# EAGLE design CBUS Pico TH adapter rev A (EAGLE 9.6.2)
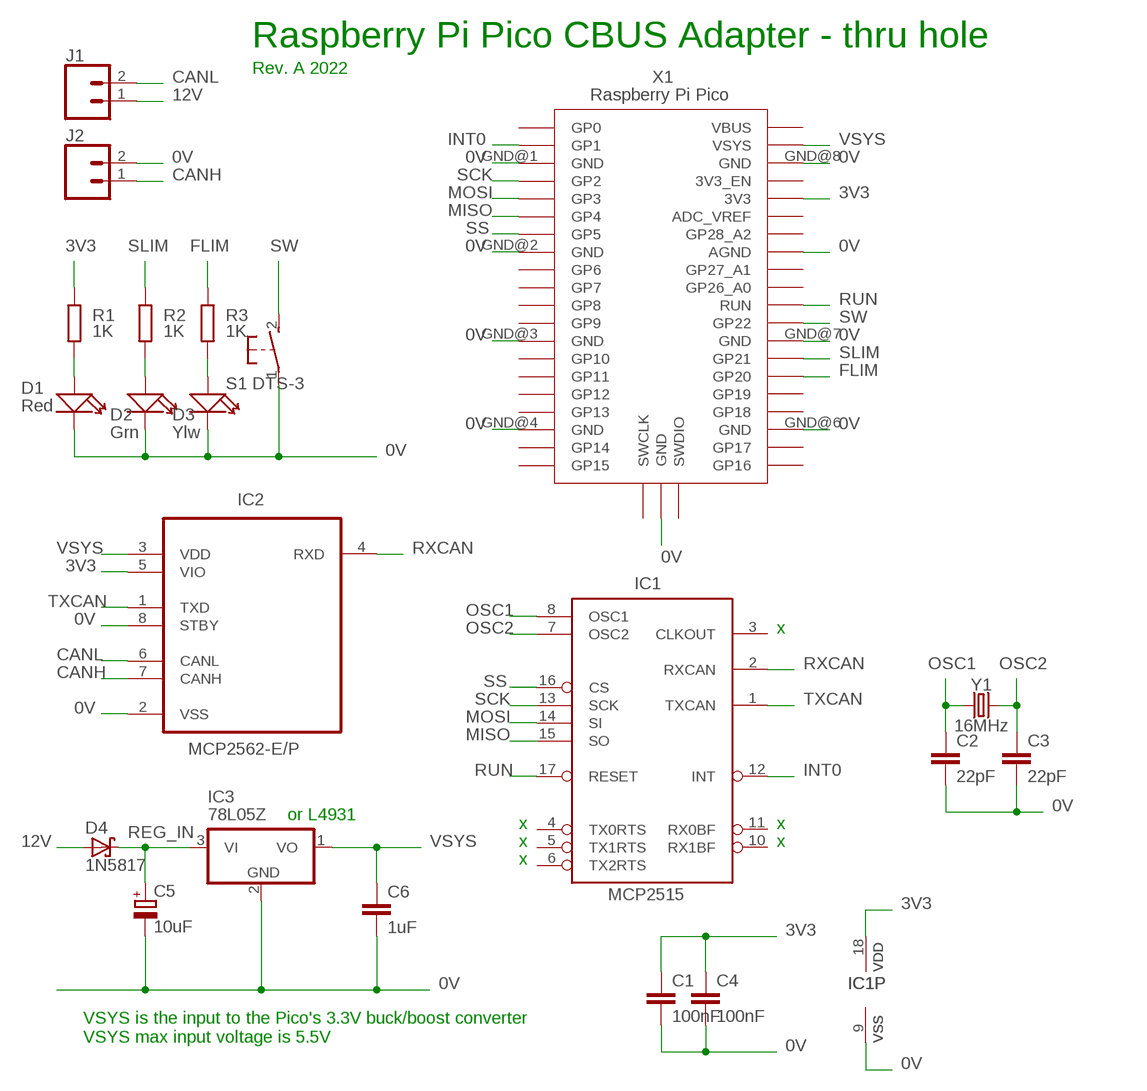
[diagram p0: schematic, sheet 1]

## Parts
C1  100nF  C-EU025-025X050  [C025-025X050]
C2  22pF  C-EU025-025X050  [C025-025X050]
C3  22pF  C-EU025-025X050  [C025-025X050]
C4  100nF  C-EU025-025X050  [C025-025X050]
C5  10uF  CPOL-EUE2-4  [E2-4]
C6  1uF  C-EU025-025X050  [C025-025X050]
D1  Red  DIP-LED-RED-RED(2P-D3MM)  [LED2-2.54-D3.0MM]
D2  Grn  DIP-LED-RED-RED(2P-D3MM)  [LED2-2.54-D3.0MM]
D3  Ylw  DIP-LED-RED-RED(2P-D3MM)  [LED2-2.54-D3.0MM]
D4  1N5817  SCHOTTKY-DIODEDO41  [DO41-10]
IC1  MCP2515  MCP2515(MCP2510)P  [DIP18]
IC2  MCP2562-E/P  [DIP254P762X533-8]
IC3  78L05Z  [TO92]
J1  CONN_023.5MM  [SCREWTERMINAL-3.5MM-2]
J2  CONN_023.5MM  [SCREWTERMINAL-3.5MM-2]
R1  1K  R-EU_0207/10  [0207/10]
R2  1K  R-EU_0207/10  [0207/10]
R3  1K  R-EU_0207/10  [0207/10]
S1  DTS-3  [DTS-3]
X1  Raspberry Pi Pico  RPI_PICO_IG-TH  [RPI_PICO_TH]
Y1  16MHz  CRYSTAL-16MHZPTH-HC49US  [HC49US]

## Nets
0V [power]: C1.2 C2.2 C3.2 C4.2 C5.- C6.2 D1.K(-) D2.K(-) D3.K(-) IC1.9(VSS) IC2.2(VSS) IC2.8(STBY) IC3.2(GND) J2.2 S1.1 X1.AGND X1.GND@1(GND) X1.GND@2(GND) X1.GND@3(GND) X1.GND@4(GND) X1.GND@5(GND) X1.GND@6(GND) X1.GND@7(GND) X1.GND@8(GND)
3V3 [power]: C1.1 C4.1 IC1.18(VDD) IC2.5(VIO) R1.1 X1.3V3
12V [power2]: D4.A J1.1
CANH: IC2.7(CANH) J2.1
CANL: IC2.6(CANL) J1.2
FLIM: R3.1 X1.GP20
INT0: IC1.12(INT) X1.GP1
MISO: IC1.15(SO) X1.GP4
MOSI: IC1.14(SI) X1.GP3
N$2: D1.A(+) R1.2
N$3: D2.A(+) R2.2
N$4: D3.A(+) R3.2
OSC1: C2.1 IC1.8(OSC1) Y1.1
OSC2: C3.1 IC1.7(OSC2) Y1.2
REG_IN [power2]: C5.+ D4.C IC3.3(VI)
RUN: IC1.17(RESET) X1.RUN
RXCAN: IC1.2(RXCAN) IC2.4(RXD)
SCK: IC1.13(SCK) X1.GP2
SLIM: R2.1 X1.GP21
SS: IC1.16(CS) X1.GP5
SW: S1.2 X1.GP22
TXCAN: IC1.1(TXCAN) IC2.1(TXD)
VSYS [power]: C6.1 IC2.3(VDD) IC3.1(VO) X1.VSYS
Unconnected: IC1.3(CLKOUT) IC1.4(TX0RTS) IC1.5(TX1RTS) IC1.6(TX2RTS) IC1.10(RX1BF) IC1.11(RX0BF) X1.3V3_EN X1.ADC_VREF X1.GP0 X1.GP6 X1.GP7 X1.GP8 X1.GP9 X1.GP10 X1.GP11 X1.GP12 X1.GP13 X1.GP14 X1.GP15 X1.GP16 X1.GP17 X1.GP18 X1.GP19 X1.GP26_A0 X1.GP27_A1 X1.GP28_A2 X1.SWCLK X1.SWDIO X1.VBUS

## Notes on the sheet
- Raspberry Pi Pico CBUS Adapter - thru hole
- Rev. A 2022
- x
- or L4931
- x | x
- x | x
- x
- VSYS is the input to the Pico's 3.3V buck/boost converter
  VSYS max input voltage is 5.5V

## Library data of the parts
C1-C4 C6 = rcl:C-EU: CAPACITOR, European symbol; SPICEPREFIX: C
C5 = rcl:CPOL-EU: POLARIZED CAPACITOR, European symbol; SPICEPREFIX: C
D1-D3 = OPL_Optoelectronics:DIP-LED-RED-RED(2P-D3MM): 304090041; MPN: SR302DC; VALUE: SR302DC
D4 = adafruit:SCHOTTKY-DIODE: Schottky Diode
IC1 = SparkFun-IC-Comms:MCP2515(MCP2510): CAN controller with SPI interface The MCP2515 controller supercedes the MCP2510 while addressing all errata associated with it. The two devices are pin compatible, either can be used with this device. 18-pin package SOIC Simple SPI interface to any MCU. One-shot mode ensures message transmission is attempted only once Databyte filtering Start-of-Frame (SOF) output Low-power CMOS Technology Datasheet <http://www.sparkfun.com/datasheets/DevTools/Arduino/MCP2515.pdf> SparkFun Products CAN-BUS Shield <https://www.sparkfun.com/products/13262> (DEV-13262); PROD_ID: NA-XXXXX; VALUE: MCP2515
IC2 = Microchip-MCP2562-E_P:MCP2562-E/P: High-Speed CAN Transceiver,DIP-8; MPN: MCP2562-E/P; OC_FARNELL: 2362838; OC_NEWARK: 85W9073; PACKAGE: DIP-8; SUPPLIER: MICROCHIP
IC3 = linear:78*: Positive VOLTAGE REGULATOR Source: http://cache.national.com/ds/LM/LM78L05.pdf http://www.fairchildsemi.com/ds/LM/LM7805.pdf
J1 J2 = SparkFun-Connectors:CONN_02: Multi connection point. Often used as Generic Header-pin footprint for 0.1 inch spaced/style header connections On any of the 0.1 inch spaced packages, you can populate with these: Break Away Headers - Straight <https://www.sparkfun.com/products/116> (PRT-00116) Break Away Male Headers - Right Angle <https://www.sparkfun.com/products/553> (PRT-00553) Female Headers <https://www.sparkfun.com/products/115> (PRT-00115) Break Away Headers - Machine Pin <https://www.sparkfun.com/products/117> (PRT-00117) Break Away Female Headers - Swiss Machine Pin <https://www.sparkfun.com/products/743> (PRT-00743) For SCREWTERMINALS and SPRING TERMINALS visit here: Screw Terimnals on SparkFun.com <https://www.sparkfun.com/search/results?term=Screw+Terminals> (5mm/3.5mm/2.54mm spacing) This device is also useful as a general connection point to wire up your design to another part of your project. Our various solder wires solder well into these plated through hole pads. Hook-Up Wire - Assortment (Stranded, 22 AWG) <https://www.sparkfun.com/products/11375> (PRT-11375) Hook-Up Wire - Assortment (Solid Core, 22 AWG) <https://www.sparkfun.com/products/11367> (PRT-11367) View the entire wire category on our website here <https://www.sparkfun.com/categories/141> Special notes: Molex polarized connector foot print use with: PRT-08233 with associated crimp pins and housings. 2.54_SCREWTERM for use with PRT-10571. 3.5mm Screw Terminal footprints for PRT-08084 5mm Screw Terminal footprints for use with PRT-08432; PROD_ID: CONN-08399
R1-R3 = rcl:R-EU_: RESISTOR, European symbol; SPICEPREFIX: R
S1 = switch_tact:DTS-3
X1 = RaspberryPi_Pico:RPI_PICO_IG
Y1 = SparkFun-Clocks:CRYSTAL-16MHZ: 16MHz Crystal Digikey Example <http://www.digikey.com/product-search/en?keywords=535-9122-1-ND> Frequency: 16MHz Frequency Stability: ±50ppm Frequency Tolerance: ±20ppm Load Capacitance: 18pF SparkFun Products: Pro Micro -5V/16MHz <https://www.sparkfun.com/products/12640> SparkFun Serial Enabled LCD Kit <https://www.sparkfun.com/products/10097>; PROD_ID: XTAL-08181; SF_ID: COM-00536

## Net classes
1 power: width 0.25 mm
2 power2: width 0.33 mm

## Board
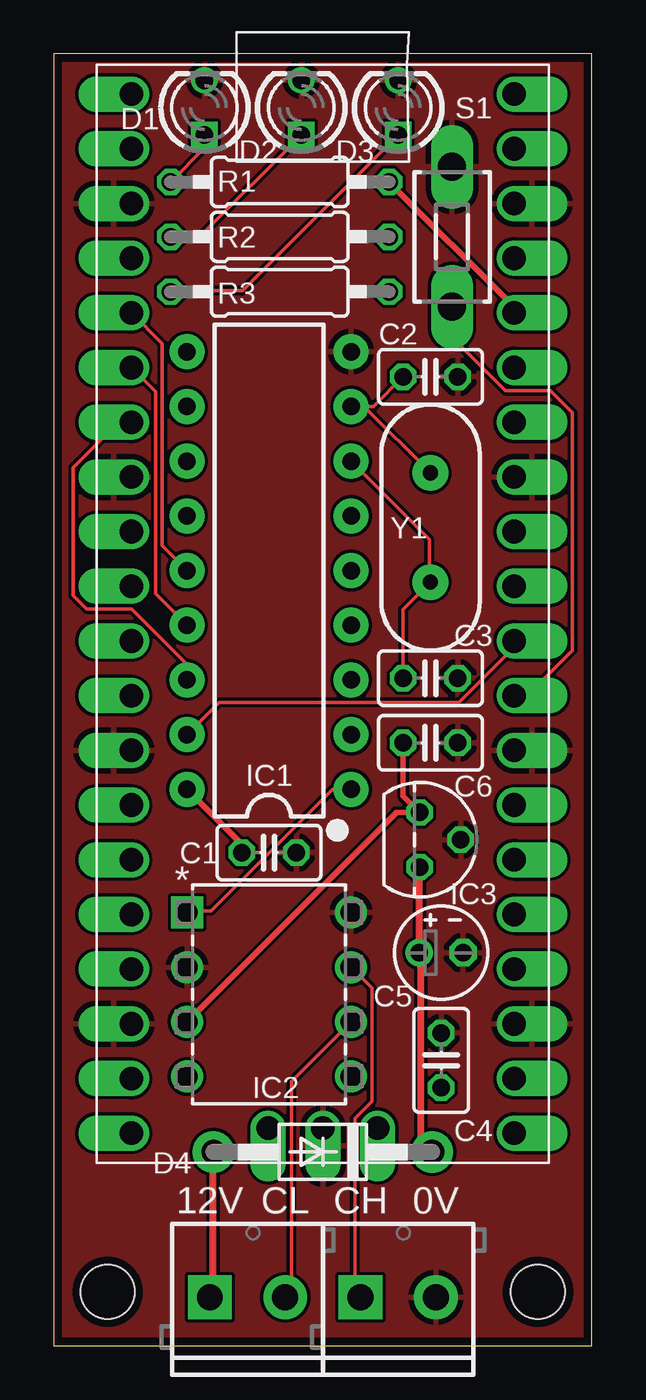
[diagram p1: board, top side]
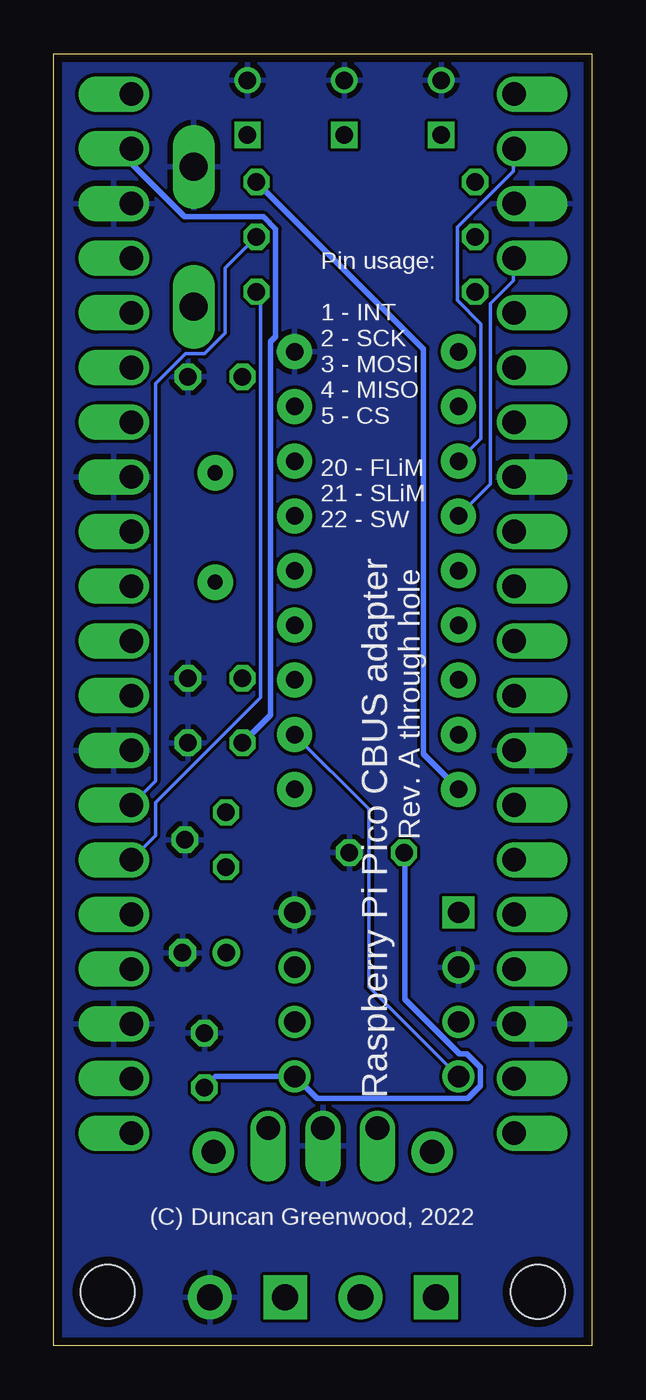
[diagram p2: board, bottom side, seen from below]

Size 25 x 60 mm. Coordinates in mm from the lower left corner, seen from the top.
Outline: 0,0 25,0 25,60 0,60 0,0
Copper layers (1*16): Top 0.0356mm / dielectric 1.5011mm / Bottom 0.0356mm
Design rules "DG_min_rules_v1": minimum track width 6mil, minimum drill 13mil, track to track 6mil, track to pad 6mil, pad to pad 6mil, via to via 6mil, smd to smd 6mil, copper to edge 15mil, drill to drill 6mil, minimum pad ring 7mil, minimum via ring 7mil, stop-mask expansion 3mil, vias tented up to drill 20mil, thermal gap 10mil
Holes 2.5 mm at 2.5,2.5 22.5,2.5

### Footprints (pad centres in the part's own frame; a part is rotated, then mirrored left to right if it is on the bottom)
C025-025X050 = drill 0.813 octagon: 1 -1.27,0; 2 1.27,0
E2-4 = drill 0.813 pad 1.27: + -1.016,0 | drill 0.813 pad 1.27 octagon: - 1.016,0
LED2-2.54-D3.0MM = drill 0.813 square: A -1.27,0 | drill 0.813: K 1.27,0
DO41-10 = drill 1.118 pad 1.93: A 5.08,0; C -5.08,0
DIP18 = drill 0.813 pad 1.626: 1 -10.16,-3.81; 2 -7.62,-3.81; 3 -5.08,-3.81; 4 -2.54,-3.81; 5 0,-3.81; 6 2.54,-3.81; 7 5.08,-3.81; 8 7.62,-3.81; 9 10.16,-3.81; 10 10.16,3.81; 11 7.62,3.81; 12 5.08,3.81; 13 2.54,3.81; 14 0,3.81; 15 -2.54,3.81; 16 -5.08,3.81; 17 -7.62,3.81; 18 -10.16,3.81
DIP254P762X533-8 = drill 0.991 square: 1 -7.62,7.62 | drill 0.991: 2 -7.62,5.08; 3 -7.62,2.54; 4 -7.62,0; 5 0,0; 6 0,2.54; 7 0,5.08; 8 0,7.62
TO92 = drill 0.813 octagon: 1 -1.27,0; 2 0,1.905; 3 1.27,0
SCREWTERMINAL-3.5MM-2 = drill 1.2 pad 2.032 square: 1 0,0 | drill 1.2 pad 2.032: 2 3.5,0
0207/10 = drill 0.813 octagon: 1 -5.08,0; 2 5.08,0
DTS-3 = drill 1.3 long: 1 -3.25,0; 2 3.25,0
RPI_PICO_TH = drill 1.1 pad 1.6 offset: 3V3 8.89,13.97; 3V3_EN 8.89,16.51; ADC_VREF 8.89,11.43; AGND 8.89,6.35; GND@1 -8.89,19.05; GND@2 -8.89,6.35; GND@3 -8.89,-6.35; GND@4 -8.89,-19.05; GND@5 0,-23.9; GND@6 8.89,-19.05; GND@7 8.89,-6.35; GND@8 8.89,19.05; GP0 -8.89,24.13; GP1 -8.89,21.59; GP2 -8.89,16.51; GP3 -8.89,13.97; GP4 -8.89,11.43; GP5 -8.89,8.89; GP6 -8.89,3.81; GP7 -8.89,1.27; GP8 -8.89,-1.27; GP9 -8.89,-3.81; GP10 -8.89,-8.89; GP11 -8.89,-11.43; GP12 -8.89,-13.97; GP13 -8.89,-16.51; GP14 -8.89,-21.59; GP15 -8.89,-24.13; GP16 8.89,-24.13; GP17 8.89,-21.59; GP18 8.89,-16.51; GP19 8.89,-13.97; GP20 8.89,-11.43; GP21 8.89,-8.89; GP22 8.89,-3.81; GP26_A0 8.89,1.27; GP27_A1 8.89,3.81; GP28_A2 8.89,8.89; RUN 8.89,-1.27; SWCLK -2.54,-23.9; SWDIO 2.54,-23.9; VBUS 8.89,24.13; VSYS 8.89,21.59
HC49US = drill 0.7 pad 1.651: 1 -2.54,0; 2 2.54,0

### Placement (x,y rotation side)
C1  10,22.9 0 top
C2  17.5,45 0 top
C3  17.5,31 0 top
C4  18,13.25 90 top
C5  18,18.25 0 top
C6  17.5,28 0 top
D1  7,57.5 90 top
D2  11.5,57.5 90 top
D3  16,57.5 90 top
D4  12.5,9 180 top
IC1  10,36 90 top
IC2  13.81,12.5 0 top
IC3  17,23.5 270 top
J1  7.25,2.25 0 top
J2  14.25,2.25 0 top
R1  10.5,54.05 180 top
R2  10.5,51.5 180 top
R3  10.5,48.95 180 top
S1  18.5,51.5 270 top
X1  12.5,34 0 top
Y1  17.5,38 270 top

### Tracks (layer width: path | path; a pad name or v marks a point on that pad's centre or on a via)
0V
  pour Top: 0,0 25,0 25,60 0,60
  pour Bottom: 0,0 25,0 25,60 0,60
3V3
  Top 0.25: X1.3V3 21.34,48.02 21.34,48.29 R1.1 | C1.1 8.69,22.94 8.69,23.34 IC1.18
  Bottom 0.25: IC1.18 7.82,27.48 7.82,46.28 R1.1 | C1.1 8.69,22.86 8.69,16.09 6.16,13.56 5.81,13.56 5.17,12.92 5.17,12.08 5.77,11.48 12.78,11.48 13.79,12.5 IC2.5 17.48,12.5 C4.1
12V
  Top 0.33: D4.A 7.39,8.97 7.39,2.39 J1.1
CANH
  Top 0.152: J2.1 14.25,2.29 13.99,2.55 13.99,10.56 14.78,11.35 14.78,16.61 IC2.7
CANL
  Top 0.152: J1.2 11.05,2.55 11.05,12.28 IC2.6
FLIM
  Bottom 0.152: X1.GP20 20.27,23.7 20.27,25.22 15.39,30.1 15.39,48.76 R3.1
INT0
  Bottom 0.152: X1.GP1 3.66,55.54 3.66,54.56 6.26,51.96 6.26,48.55 5.15,47.44 5.15,42.12 IC1.12
MISO
  Top 0.152: X1.GP4 4.72,44.32 4.72,34.93 IC1.15
MOSI
  Top 0.152: X1.GP3 5.03,46.55 5.03,37.16 IC1.14
N$2
  Top 0.152: D1.A 7,55.63 R1.2
N$3
  Top 0.152: R2.2 5.43,51.51 6.78,51.51 D2.A
N$4
  Top 0.152: D3.A 8.76,49 5.47,49 R3.2
OSC1
  Top 0.152: C2.1 14.85,43.62 IC1.8 14.42,43.62 Y1.1
OSC2
  Top 0.152: IC1.7 17.45,37.44 17.45,35.51 Y1.2 16.23,34.19 C3.1
REG_IN
  Top 0.33: IC3.3 16.99,18.26 C5.+ 17.07,18.16 17.07,9.53 17.58,9.01 D4.C
RUN
  Top 0.152: X1.RUN 21.34,32.68 21.34,32.38 18.83,29.87 7.68,29.87 IC1.17
RXCAN
  Bottom 0.152: IC1.2 13.81,28.36 10.36,24.92 10.36,16.67 IC2.4
SCK
  Bottom 0.152: X1.GP2 3.66,50.46 3.66,49.45 4.72,48.39 4.72,40.01 IC1.13
SLIM
  Bottom 0.152: X1.GP21 20.27,26.23 20.27,44.69 18.88,46.07 18,46.07 17.04,47.03 17.04,50.04 R2.1
SS
  Top 0.152: X1.GP5 3.54,42.82 2.94,42.82 0.91,40.79 0.91,34.83 1.53,34.21 3.62,34.21 6.17,31.66 6.17,30.94 IC1.16
SW
  Top 0.152: S1.2 18.52,48.23 18.52,46.81 20.98,44.35 23.07,44.35 24.09,43.33 24.09,32.29 22.05,30.25 21.45,30.25 X1.GP22
TXCAN
  Top 0.152: IC1.1 12.95,25.83 7.32,20.19 6.26,20.19 IC2.1
VSYS
  Top 0.25: IC2.3 15.92,24.77 IC3.1 16.23,25.54 C6.1
  Bottom 0.25: X1.VSYS 21.34,55.54 21.34,54.84 18.92,52.43 15.25,52.43 14.69,51.87 14.69,46.88 14.94,46.63 14.94,29.3 C6.1

### Text on the board
tPlace: 12V | CL | CH | 0V
bPlace: Pin usage: / / 1 - INT / 2 - SCK / 3 - MOSI / 4 - MISO / 5 - CS / / 20 - FLiM / 21 - SLiM / 22 - SW | Rev. A through hole | Raspberry Pi Pico CBUS adapter | (C) Duncan Greenwood, 2022